# EAGLE design Enclosure 100x68 AMux-M (EAGLE 9.6.2)
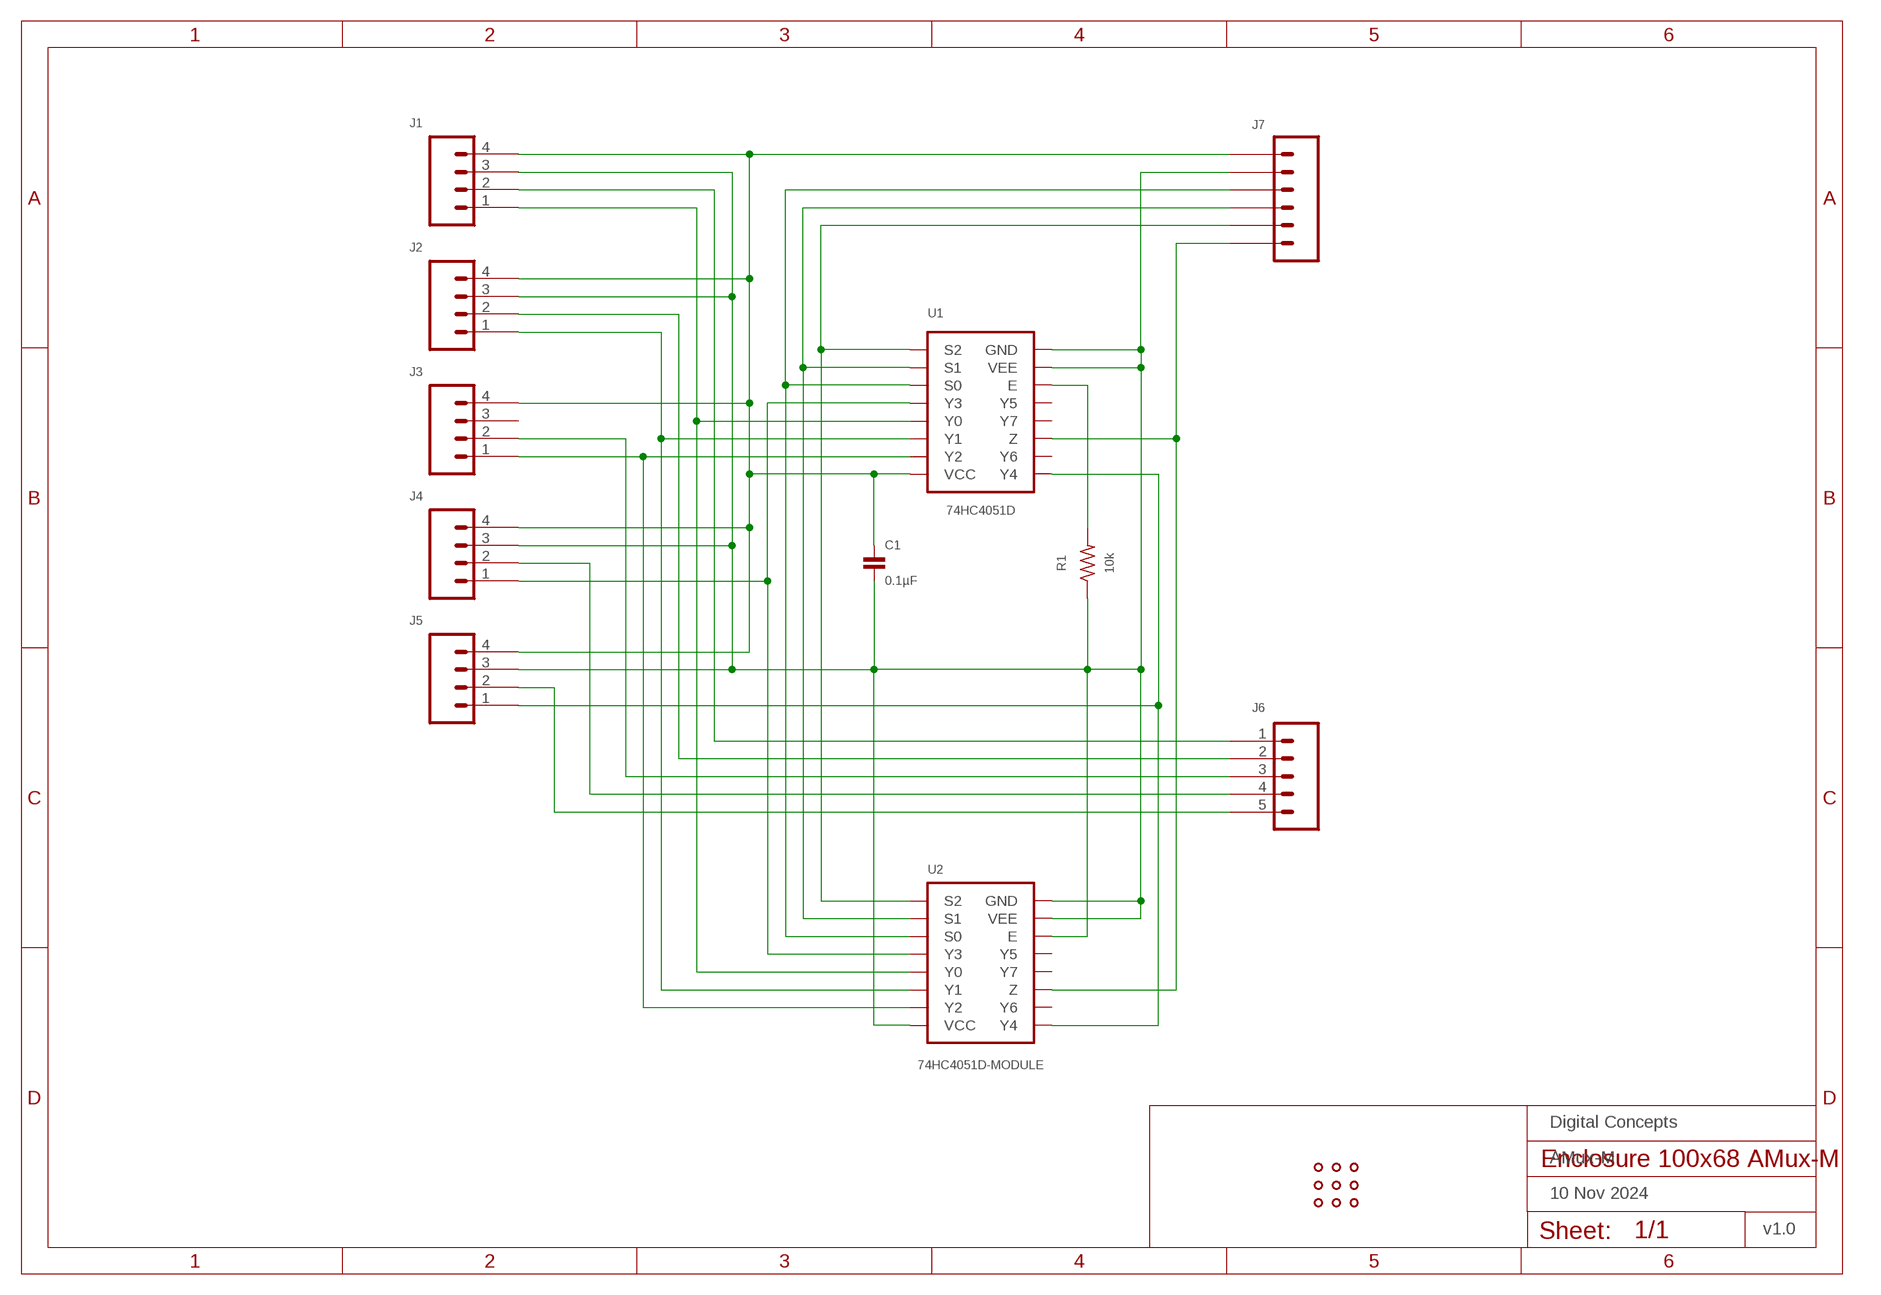
[diagram p0: schematic, sheet 1]
FRAME1 (A4L-LOC): DATE: 10 Nov 2024; OWNER: Digital Concepts; TITLE: AMux-M; VERSION: v1.0

## Parts
C1  0.1µF  CAPACITOR-0805  [C0805]
J1  HEADER-1X4-GENERIC  [CONN_04-GENERIC]
J2  HEADER-1X4-GENERIC  [CONN_04-GENERIC]
J3  HEADER-1X4-GENERIC  [CONN_04-GENERIC]
J4  HEADER-1X4-GENERIC  [CONN_04-GENERIC]
J5  HEADER-1X4-GENERIC  [CONN_04-GENERIC]
J6  JST-PH2.0-5-HORIZONTAL  [JST-PH2.0-5-HORIZONTAL]
J7  JST-PH2.0-6-HORIZONTAL  [JST-PH2.0-6-HORIZONTAL]
R1  10k  RESISTORR0805  [R0805]
U1  74HC4051D  [SOP16]
U2  74HC4051D-MODULE  [74HC4051D-MODULE]
U$1  PROTO-34X22-AMUX  [PROTO-34X22-AMUX]

## Nets
GND: C1.2 J1.3 J2.3 J4.3 J5.3 J7.2 R1.1 U1.7(VEE) U1.8(GND) U2.E U2.GND@L(GND) U2.GND@R(GND) U2.VCC@L(VCC) U2.VCC@R(VCC) U2.VEE@L(VEE) U2.VEE@R(VEE)
N$1: J4.1 U1.12(Y3) U2.Y3
N$2: J2.1 U1.14(Y1) U2.Y1
N$3: J1.1 U1.13(Y0) U2.Y0
N$4: J3.1 U1.15(Y2) U2.Y2
N$5: J5.1 U1.1(Y4) U2.Y4
N$6: J7.3 U1.11(S0) U2.S0
N$7: J7.4 U1.10(S1) U2.S1
N$8: R1.2 U1.6(E)
N$9: J7.6 U1.3(Z) U2.Z
N$13: J1.2 J6.1
N$16: J7.5 U1.9(S2) U2.S2
N$17: J2.2 J6.2
N$18: J3.2 J6.3
N$19: J4.2 J6.4
N$20: J5.2 J6.5
N$26: C1.1 J1.4 J2.4 J3.4 J4.4 J5.4 J7.1 U1.16(VCC)
Unconnected: J3.3 U1.2(Y6) U1.4(Y7) U1.5(Y5) U2.Y5 U2.Y6 U2.Y7

## Library data of the parts
C1 = digitalconcepts:CAPACITOR-0805: 0805 Capacitor
J1-J5 = digitalconcepts:HEADER-1X4-GENERIC: Single Row 4-Pin Header
J6 = digitalconcepts:JST-PH2.0-5-HORIZONTAL: PH2.0 5P Horizontal Connector
J7 = digitalconcepts:JST-PH2.0-6-HORIZONTAL: PH2.0 6P Horizontal Connector
R1 = digitalconcepts:RESISTOR: Resistor; SPICEPREFIX: R
U1 = digitalconcepts:74HC4051D: 74HC4051 8-Port Multiplexer SOP-16
U2 = digitalconcepts:74HC4051D-MODULE: 74HC4051 8-Port Analog Multiplexer Module
U$1 = digitalconcepts:PROTO-34X22-AMUX: 34 x 22 Analog Mux Prototyping board to fit an 100 x 68 enclosure

## Board
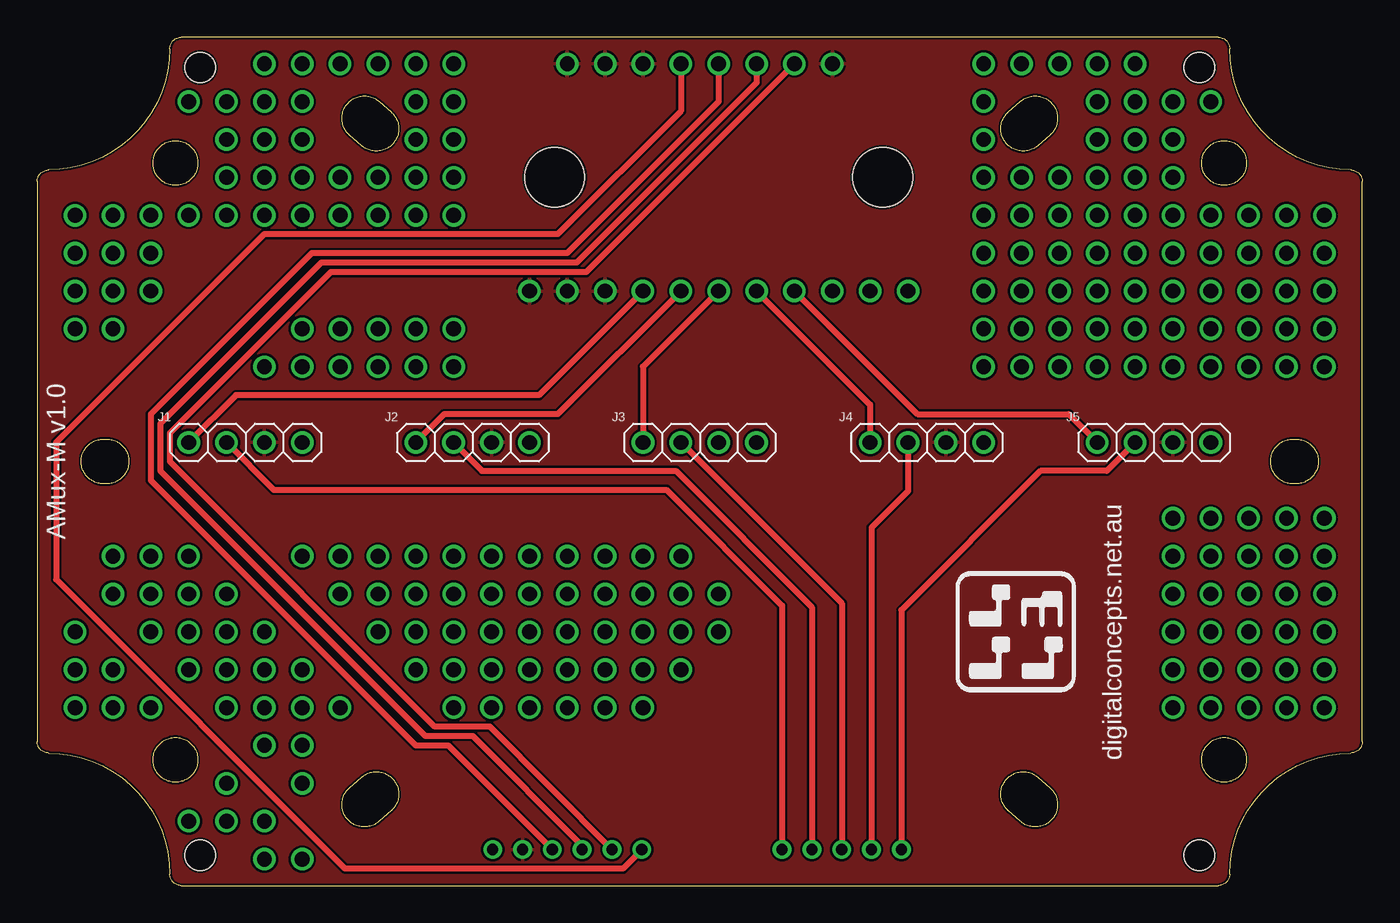
[diagram p1: board, top side]
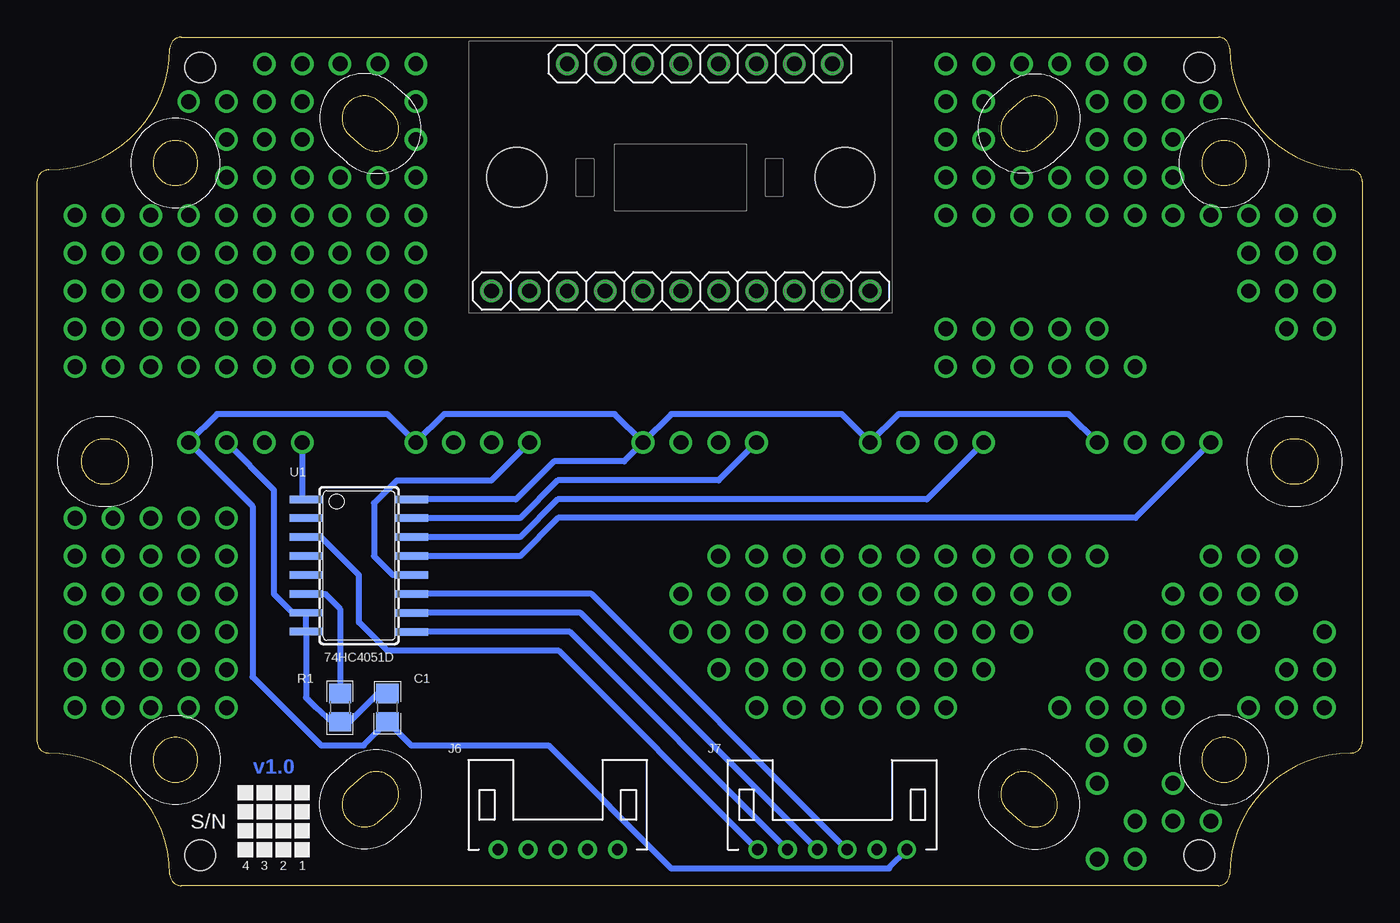
[diagram p2: board, bottom side, seen from below]

Size 88.9 x 56.9 mm. Coordinates in mm from the lower left corner, seen from the top.
Copper layers (1*16): Top 0.035mm / dielectric 1.5mm / Bottom 0.035mm
Design rules "default *": minimum track width 6mil, minimum drill 0.35mm, track to track 6mil, track to pad 6mil, pad to pad 6mil, via to via 6mil, smd to smd 6mil, copper to edge 6mil, drill to drill 6mil, minimum pad ring 10mil, minimum via ring 8mil, stop-mask expansion 4mil, vias tented up to drill 0mil, thermal gap 6mil

### Footprints (pad centres in the part's own frame; a part is rotated, then mirrored left to right if it is on the bottom)
C0805 = smd 1.3 x 1.5: 1 -0.95,0; 2 0.95,0
CONN_04-GENERIC = drill 1 pad 1.524: 1 0,0; 2 2.54,0; 3 5.08,0; 4 7.62,0
JST-PH2.0-5-HORIZONTAL = drill 0.75: 1 4,0; 2 2,0; 3 0,0; 4 -2,0; 5 -4,0
JST-PH2.0-6-HORIZONTAL = drill 0.75: 1 5,0; 2 3,0; 3 1,0; 4 -1,0; 5 -3,0; 6 -5,0
R0805 = smd 1.3 x 1.5: 1 -0.95,0; 2 0.95,0
SOP16 = smd 0.5 x 2.2: 1 -4.445,-3.55; 2 -3.185,-3.55; 3 -1.915,-3.55; 4 -0.645,-3.55; 5 0.635,-3.55; 6 1.895,-3.55; 7 3.165,-3.55; 8 4.435,-3.55; 9 4.445,3.55; 10 3.175,3.55; 11 1.905,3.55; 12 0.635,3.55; 13 -0.635,3.55; 14 -1.905,3.55; 15 -3.175,3.55; 16 -4.445,3.55
74HC4051D-MODULE = drill 1: E 0,5.08; GND@L 0,17.78; GND@R 15.24,20.32; S0 0,12.7; S1 0,10.16; S2 0,7.62; VCC@L 0,20.32; VCC@R 15.24,22.86; VEE@L 0,22.86; VEE@R 15.24,25.4; Y0 15.24,17.78; Y1 15.24,15.24; Y2 15.24,12.7; Y3 15.24,10.16; Y4 15.24,7.62; Y5 15.24,5.08; Y6 15.24,2.54; Y7 15.24,0; Z 0,15.24 | hole 4: 7.62,23.7; 7.62,1.7
PROTO-34X22-AMUX = drill 1: P01-05 -41.91,-16.51; P01-06 -41.91,-13.97; P01-07 -41.91,-11.43; P01-15 -41.91,8.89; P01-16 -41.91,11.43; P01-17 -41.91,13.97; P01-18 -41.91,16.51; P02-05 -39.37,-16.51; P02-06 -39.37,-13.97; P02-08 -39.37,-8.89; P02-09 -39.37,-6.35; P02-15 -39.37,8.89; P02-16 -39.37,11.43; P02-17 -39.37,13.97; P02-18 -39.37,16.51; P03-05 -36.83,-16.51; P03-07 -36.83,-11.43; P03-08 -36.83,-8.89; P03-09 -36.83,-6.35; P03-16 -36.83,11.43; P03-17 -36.83,13.97; P03-18 -36.83,16.51; P04-02 -34.29,-24.13; P04-06 -34.29,-13.97; P04-07 -34.29,-11.43; P04-08 -34.29,-8.89; P04-09 -34.29,-6.35; P04-18 -34.29,16.51; P04-21 -34.29,24.13; P05-02 -31.75,-24.13; P05-03 -31.75,-21.59; P05-05 -31.75,-16.51; P05-06 -31.75,-13.97; P05-07 -31.75,-11.43; P05-08 -31.75,-8.89; P05-18 -31.75,16.51; P05-19 -31.75,19.05; P05-20 -31.75,21.59; P05-21 -31.75,24.13; P06-01 -29.21,-26.67; P06-02 -29.21,-24.13; P06-04 -29.21,-19.05; P06-05 -29.21,-16.51; P06-06 -29.21,-13.97; P06-07 -29.21,-11.43; P06-14 -29.21,6.35; P06-18 -29.21,16.51; P06-19 -29.21,19.05; P06-20 -29.21,21.59; P06-21 -29.21,24.13; P06-22 -29.21,26.67; P07-01 -26.67,-26.67; P07-03 -26.67,-21.59; P07-04 -26.67,-19.05; P07-05 -26.67,-16.51; P07-06 -26.67,-13.97; P07-09 -26.67,-6.35; P07-14 -26.67,6.35; P07-15 -26.67,8.89; P07-18 -26.67,16.51; P07-19 -26.67,19.05; P07-20 -26.67,21.59; P07-21 -26.67,24.13; P07-22 -26.67,26.67; P08-05 -24.13,-16.51; P08-08 -24.13,-8.89; P08-09 -24.13,-6.35; P08-14 -24.13,6.35; P08-15 -24.13,8.89; P08-18 -24.13,16.51; P08-19 -24.13,19.05; P08-22 -24.13,26.67; P09-07 -21.59,-11.43; P09-08 -21.59,-8.89; P09-09 -21.59,-6.35; P09-14 -21.59,6.35; P09-15 -21.59,8.89; P09-18 -21.59,16.51; P09-19 -21.59,19.05; P09-22 -21.59,26.67; P10-06 -19.05,-13.97; P10-07 -19.05,-11.43; P10-08 -19.05,-8.89; P10-09 -19.05,-6.35; P10-14 -19.05,6.35; P10-15 -19.05,8.89; P10-18 -19.05,16.51; P10-19 -19.05,19.05; P10-20 -19.05,21.59; P10-21 -19.05,24.13; P10-22 -19.05,26.67; P11-05 -16.51,-16.51; P11-06 -16.51,-13.97; P11-07 -16.51,-11.43; P11-08 -16.51,-8.89; P11-09 -16.51,-6.35; P11-14 -16.51,6.35; P11-15 -16.51,8.89; P11-18 -16.51,16.51; P11-19 -16.51,19.05; P11-20 -16.51,21.59; P11-21 -16.51,24.13; P11-22 -16.51,26.67; P12-05 -13.97,-16.51; P12-06 -13.97,-13.97; P12-07 -13.97,-11.43; P12-08 -13.97,-8.89; P12-09 -13.97,-6.35; P13-05 -11.43,-16.51; P13-06 -11.43,-13.97; P13-07 -11.43,-11.43; P13-08 -11.43,-8.89; P13-09 -11.43,-6.35; P14-05 -8.89,-16.51; P14-06 -8.89,-13.97; P14-07 -8.89,-11.43; P14-08 -8.89,-8.89; P14-09 -8.89,-6.35; P15-05 -6.35,-16.51; P15-06 -6.35,-13.97; P15-07 -6.35,-11.43; P15-08 -6.35,-8.89; P15-09 -6.35,-6.35; P16-05 -3.81,-16.51; P16-06 -3.81,-13.97; P16-07 -3.81,-11.43; P16-08 -3.81,-8.89; P16-09 -3.81,-6.35; P17-06 -1.27,-13.97; P17-07 -1.27,-11.43; P17-08 -1.27,-8.89; P17-09 -1.27,-6.35; P18-07 1.27,-11.43; P18-08 1.27,-8.89; P25-14 19.05,6.35; P25-15 19.05,8.89; P25-16 19.05,11.43; P25-17 19.05,13.97; P25-18 19.05,16.51; P25-19 19.05,19.05; P25-20 19.05,21.59; P25-21 19.05,24.13; P25-22 19.05,26.67; P26-14 21.59,6.35; P26-15 21.59,8.89; P26-16 21.59,11.43; P26-17 21.59,13.97; P26-18 21.59,16.51; P26-19 21.59,19.05; P26-22 21.59,26.67; P27-14 24.13,6.35; P27-15 24.13,8.89; P27-16 24.13,11.43; P27-17 24.13,13.97; P27-18 24.13,16.51; P27-19 24.13,19.05; P27-22 24.13,26.67; P28-14 26.67,6.35; P28-15 26.67,8.89; P28-16 26.67,11.43; P28-17 26.67,13.97; P28-18 26.67,16.51; P28-19 26.67,19.05; P28-20 26.67,21.59; P28-21 26.67,24.13; P28-22 26.67,26.67; P29-14 29.21,6.35; P29-15 29.21,8.89; P29-16 29.21,11.43; P29-17 29.21,13.97; P29-18 29.21,16.51; P29-19 29.21,19.05; P29-20 29.21,21.59; P29-21 29.21,24.13; P29-22 29.21,26.67; P30-05 31.75,-16.51; P30-06 31.75,-13.97; P30-07 31.75,-11.43; P30-08 31.75,-8.89; P30-09 31.75,-6.35; P30-10 31.75,-3.81; P30-14 31.75,6.35; P30-15 31.75,8.89; P30-16 31.75,11.43; P30-17 31.75,13.97; P30-18 31.75,16.51; P30-19 31.75,19.05; P30-20 31.75,21.59; P30-21 31.75,24.13; P31-05 34.29,-16.51; P31-06 34.29,-13.97; P31-07 34.29,-11.43; P31-08 34.29,-8.89; P31-09 34.29,-6.35; P31-10 34.29,-3.81; P31-14 34.29,6.35; P31-15 34.29,8.89; P31-16 34.29,11.43; P31-17 34.29,13.97; P31-18 34.29,16.51; P31-21 34.29,24.13; P32-05 36.83,-16.51; P32-06 36.83,-13.97; P32-07 36.83,-11.43; P32-08 36.83,-8.89; P32-10 36.83,-3.81; P32-14 36.83,6.35; P32-15 36.83,8.89; P32-16 36.83,11.43; P32-17 36.83,13.97; P32-18 36.83,16.51; P33-05 39.37,-16.51; P33-06 39.37,-13.97; P33-07 39.37,-11.43; P33-08 39.37,-8.89; P33-10 39.37,-3.81; P33-14 39.37,6.35; P33-15 39.37,8.89; P33-16 39.37,11.43; P33-17 39.37,13.97; P33-18 39.37,16.51; P34-05 41.91,-16.51; P34-06 41.91,-13.97; P34-07 41.91,-11.43; P34-08 41.91,-8.89; P34-09 41.91,-6.35; P34-10 41.91,-3.81; P34-14 41.91,6.35; P34-15 41.91,8.89; P34-16 41.91,11.43; P34-17 41.91,13.97; P34-18 41.91,16.51; P303 36.83,-6.35; P304 39.37,-6.35 | hole 2.032: -33.528,26.416; 33.528,26.416; 33.528,-26.416; -33.528,-26.416

### Placement (x,y rotation side)
C1  65.41,11.94 90 bottom
J1  10.16,29.72 0 top
J2  25.4,29.72 0 top
J3  40.64,29.72 0 top
J4  55.88,29.72 0 top
J5  71.12,29.72 0 top
J6  53.98,2.41 0 bottom
J7  35.56,2.41 0 bottom
R1  68.58,11.94 90 bottom
U1  67.31,21.46 270 bottom
U2  58.42,55.12 270 bottom
U$1  44.45,28.45 0 top

### Tracks (layer width: path | path; a pad name or v marks a point on that pad's centre or on a via)
GND
  Bottom 0.406: C1.2 66.05,12.89 67.95,10.99 R1.1 69.16,10.99 70.23,11.96 70.86,12.6 U1.8 U1.7 71.76,18.3 73.03,19.57 73.03,26.54 J5.3
  pour Top: -0.63,57.66 89.54,57.66 89.54,-0.76 -0.63,-0.76
N$1
  Top 0.406: U2.Y3 55.88,32.26 J4.1
  Bottom 0.406: J4.1 58.42,27.18 64.77,27.18 66.3,25.65 66.3,22.1 65.03,20.83 U1.12
N$2
  Top 0.406: U2.Y1 34.93,31.62 27.31,31.62 J2.1
  Bottom 0.406: J2.1 29.21,25.91 53.98,25.91 56.52,23.37 U1.14
N$3
  Top 0.406: U2.Y0 33.66,32.89 13.34,32.89 J1.1
  Bottom 0.406: J1.1 15.22,24.66 53.96,24.66 56.52,22.1 U1.13
N$4
  Top 0.406: U2.Y2 40.64,34.8 J3.1
  Bottom 0.406: J3.1 43.18,27.18 53.98,27.18 56.52,24.64 U1.15
N$5
  Top 0.406: U2.Y4 59.06,31.62 69.22,31.62 J5.1
  Bottom 0.406: U1.1 71.12,25.91 J5.1
N$6
  Top 0.406: U2.S0 45.72,52.58 35.56,42.42 18.42,42.42 7.62,31.62 7.62,27.18 25.4,9.4 27.58,9.4 J7.3
  Bottom 0.406: U1.11 51.71,19.56 J7.3
N$7
  Top 0.406: U2.S1 48.26,53.85 36.2,41.78 19.05,41.78 8.26,30.99 8.26,27.81 26.04,10.03 29.21,10.03 36.56,2.68 J7.4
  Bottom 0.406: J7.4 52.44,18.29 U1.10
N$8
  Bottom 0.406: R1.2 68.58,18.56 69.59,19.57 U1.6
N$9
  Top 0.406: U2.Z 43.18,51.94 34.93,43.69 15.24,43.69 1.27,29.72 1.27,20.53 20.66,1.14 39.29,1.14 J7.6
  Bottom 0.406: J7.6 53.9,15.75 65.41,15.75 67.31,17.65 67.31,20.83 69.86,23.38 U1.3
N$13
  Top 0.406: J6.1 49.98,18.78 42.21,26.54 15.88,26.54 J1.2
N$16
  Top 0.406: U2.S2 36.83,41.15 19.69,41.15 8.89,30.35 8.89,28.45 26.67,10.67 30.38,10.67 J7.5
  Bottom 0.406: J7.5 53.17,17.02 U1.9
N$17
  Top 0.406: J6.2 51.98,18.68 42.84,27.81 29.85,27.81 J2.2
N$18
  Top 0.406: J6.3 53.98,18.92 J3.2
N$19
  Top 0.406: J6.4 55.98,24 58.42,26.45 J4.2
N$20
  Top 0.406: J6.5 57.98,18.48 67.31,27.81 71.76,27.81 J5.2
N$26
  Bottom 0.406: J1.4 19.69,31.62 31.12,31.62 J2.4 34.93,31.62 46.36,31.62 J3.4 | J3.4 50.17,31.62 61.59,31.62 J4.4 65.41,31.62 76.84,31.62 J5.4 74.46,25.43 74.46,14 69.85,9.4 67,9.4 C1.1 63.82,9.4 54.61,9.4 46.36,1.14 31.75,1.14 31.75,1.22 J7.1 | J3.4 49.53,28.45 54.24,28.45 56.78,25.91 U1.16

### Text on the board
Bottom: v1.0
tPlace: AMux-M v1.0 | digitalconcepts.net.au
bPlace: S/N | 1 | 2 | 3 | 4